# EAGLE design me433-2021 (EAGLE 9.6.2)
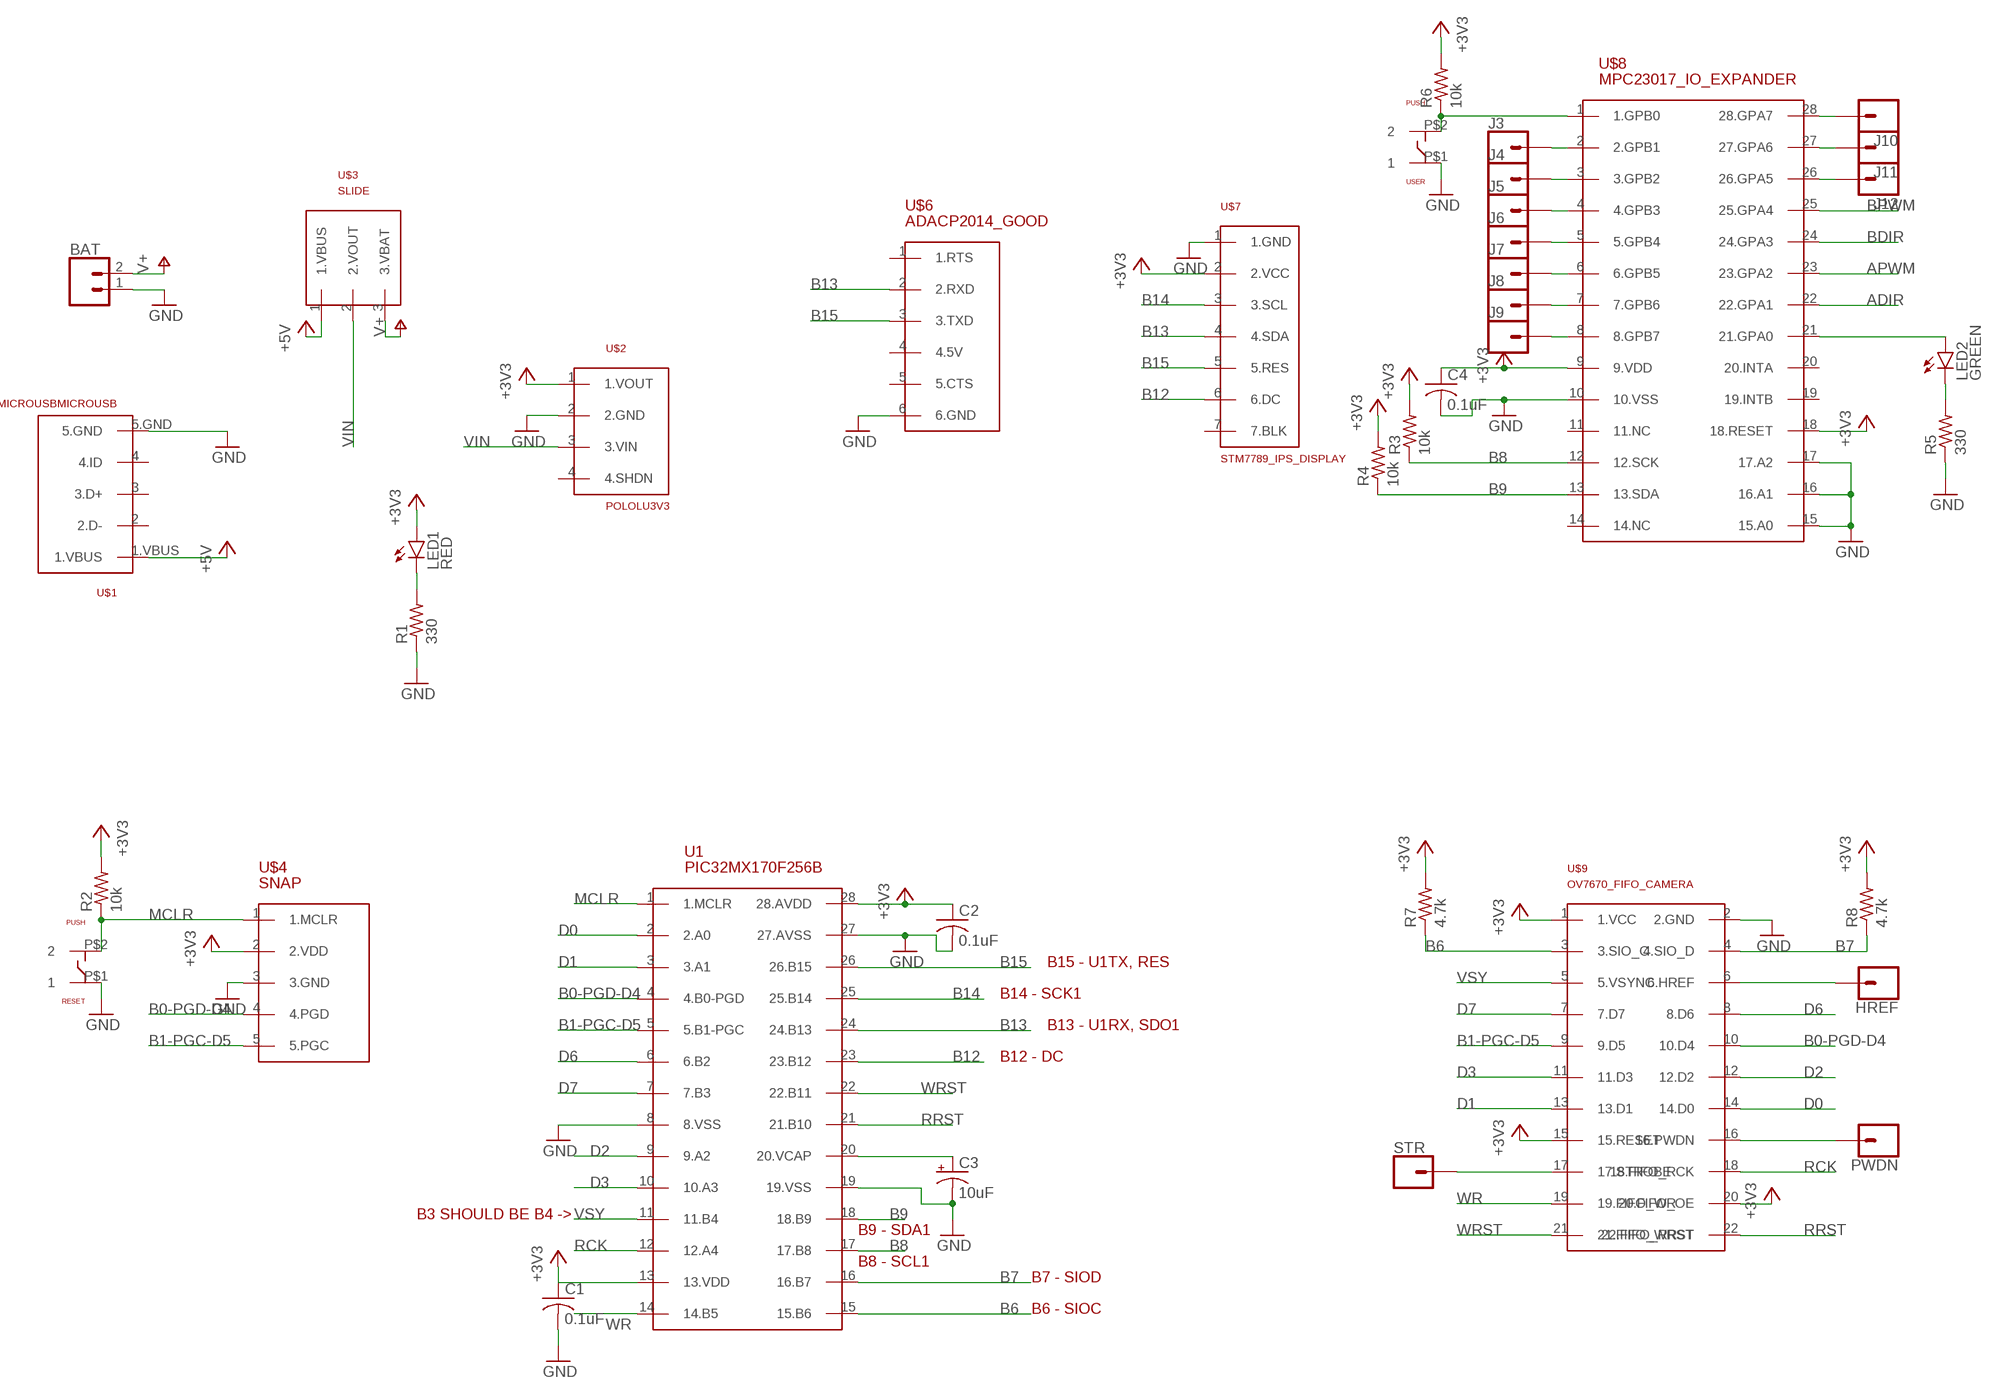
[diagram p0: schematic, sheet 1, part 1 of 2]
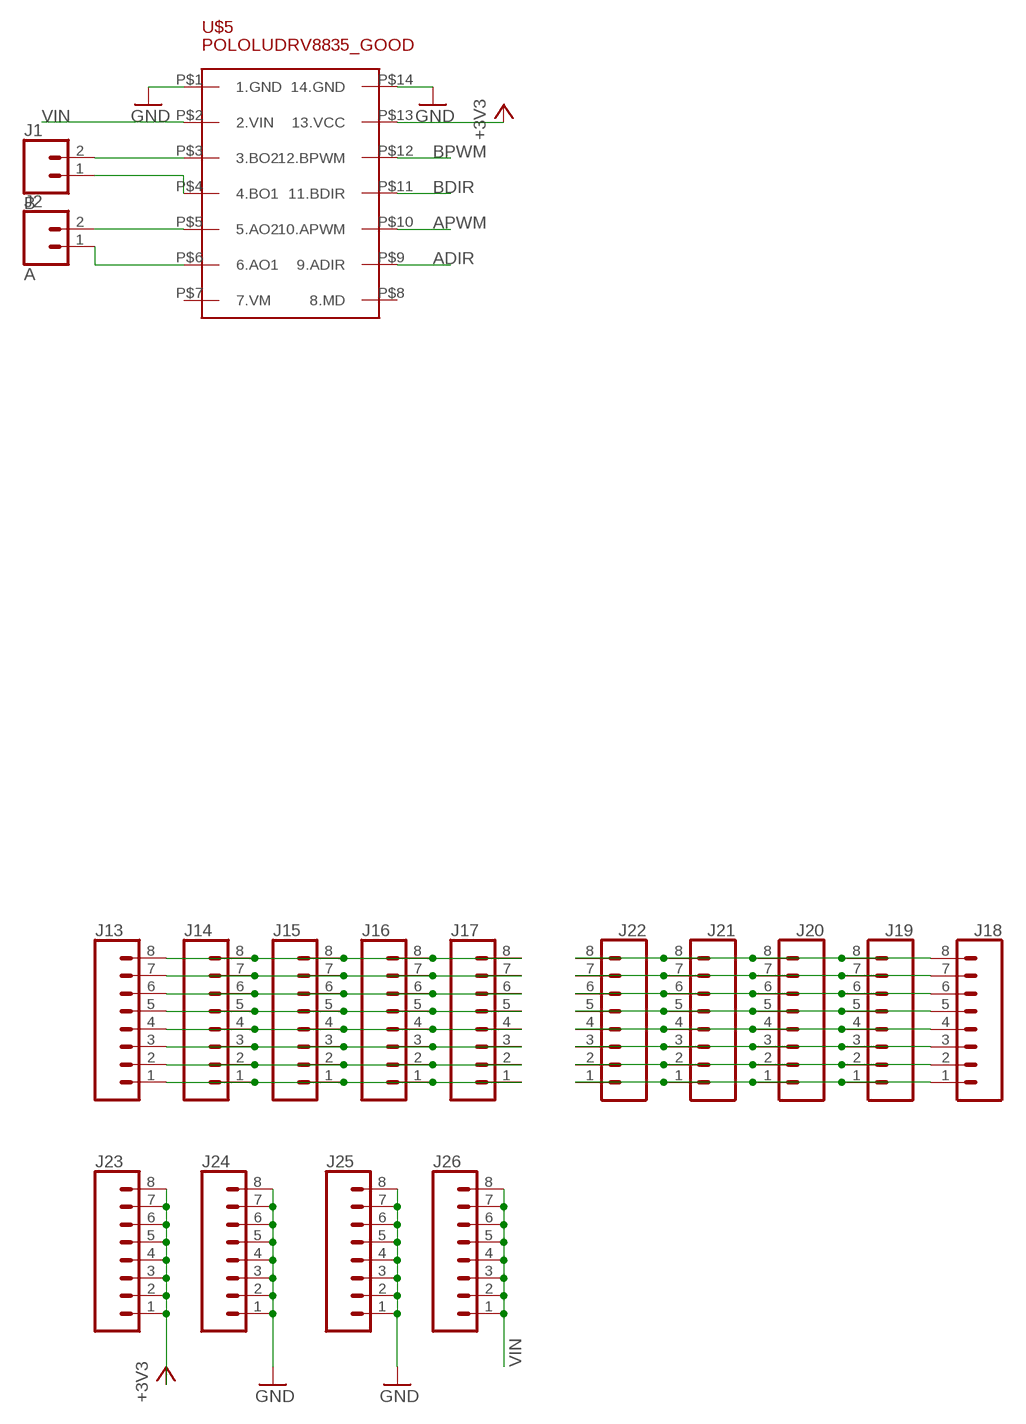
[diagram p1: schematic, sheet 1, part 2 of 2]

## Parts
BAT  CONN_02  [1X02]
C1  0.1uF  C-US025-030X050  [C025-030X050]
C2  0.1uF  C-US025-030X050  [C025-030X050]
C3  10uF  CPOL-USB45181B  [B45181B]
C4  0.1uF  C-US025-030X050  [C025-030X050]
HREF  CONN_01  [1X01]
J1  B  CONN_02  [1X02]
J2  A  CONN_02  [1X02]
J3  CONN_01  [1X01]
J4  CONN_01  [1X01]
J5  CONN_01  [1X01]
J6  CONN_01  [1X01]
J7  CONN_01  [1X01]
J8  CONN_01  [1X01]
J9  CONN_01  [1X01]
J10  CONN_01  [1X01]
J11  CONN_01  [1X01]
J12  CONN_01  [1X01]
J13  CONN_08"  [1X08]
J14  CONN_08"  [1X08]
J15  CONN_08"  [1X08]
J16  CONN_08"  [1X08]
J17  CONN_08"  [1X08]
J18  CONN_08"  [1X08]
J19  CONN_08"  [1X08]
J20  CONN_08"  [1X08]
J21  CONN_08"  [1X08]
J22  CONN_08"  [1X08]
J23  CONN_08"  [1X08]
J24  CONN_08"  [1X08]
J25  CONN_08"  [1X08]
J26  CONN_08"  [1X08]
LED1  RED  LED3MM  [LED3MM]
LED2  GREEN  LED3MM  [LED3MM]
PWDN  CONN_01  [1X01]
R1  330  R-US_0207/10  [0207/10]
R2  10k  R-US_0207/10  [0207/10]
R3  10k  R-US_0207/10  [0207/10]
R4  10k  R-US_0207/10  [0207/10]
R5  330  R-US_0207/10  [0207/10]
R6  10k  R-US_0207/10  [0207/10]
R7  4.7k  R-US_0207/10  [0207/10]
R8  4.7k  R-US_0207/10  [0207/10]
RESET  PUSH  [PUSH]
STR  CONN_01  [1X01]
U1  PIC32MX170F256B  [DIL28-3]
U$1  MICROUSBMICROUSB  [MICROUSB]
U$2  POLOLU3V3  [POLOLU3V3]
U$3  SLIDE  [SLIDE]
U$4  SNAP  [1X05]
U$5  POLOLUDRV8835_GOOD  [POLOLU_DRV8835_H_BRIDGE_BREAKOUT]
U$6  ADACP2014_GOOD  [1X06]
U$7  STM7789_IPS_DISPLAY  [1X07]
U$8  MPC23017_IO_EXPANDER  [DIL28-3]
U$9  OV7670_FIFO_CAMERA  [2X12]
USER  PUSH  [PUSH]

## Nets
+3V3: C2.1 C4.1 J23.1 J23.2 J23.3 J23.4 J23.5 J23.6 J23.7 J23.8 LED1.A R2.2 R3.2 R4.2 R6.2 R7.2 R8.2 U1.28(28.AVDD) U$2.1(1.VOUT) U$4.2(2.VDD) U$5.P$13(13.VCC) U$7.2(2.VCC) U$8.9(9.VDD) U$8.18(18.RESET) U$9.1(1.VCC) U$9.15(15.RESET) U$9.20(20.FIFO_OE)
+5V: U$1.1.VBUS U$3.1(1.VBUS)
ADIR: U$5.P$9(9.ADIR) U$8.22(22.GPA1)
APWM: U$5.P$10(10.APWM) U$8.23(23.GPA2)
B0-PGD-D4: U1.4(4.B0-PGD) U$4.4(4.PGD) U$9.10(10.D4)
B1-PGC-D5: U1.5(5.B1-PGC) U$4.5(5.PGC) U$9.9(9.D5)
B6: R7.1 U1.15(15.B6) U$9.3(3.SIO_C)
B7: R8.1 U1.16(16.B7) U$9.4(4.SIO_D)
B8: R3.1 U1.17(17.B8) U$8.12(12.SCK)
B9: R4.1 U1.18(18.B9) U$8.13(13.SDA)
B12: U1.23(23.B12) U$7.6(6.DC)
B13: U1.24(24.B13) U$6.2(2.RXD) U$7.4(4.SDA)
B14: U1.25(25.B14) U$7.3(3.SCL)
B15: U1.26(26.B15) U$6.3(3.TXD) U$7.5(5.RES)
BDIR: U$5.P$11(11.BDIR) U$8.24(24.GPA3)
BPWM: U$5.P$12(12.BPWM) U$8.25(25.GPA4)
D0: U1.2(2.A0) U$9.14(14.D0)
D1: U1.3(3.A1) U$9.13(13.D1)
D2: U1.9(9.A2) U$9.12(12.D2)
D3: U1.10(10.A3) U$9.11(11.D3)
D6: U1.6(6.B2) U$9.8(8.D6)
D7: U1.7(7.B3) U$9.7(7.D7)
GND: BAT.1 C1.2 C2.2 C3.- C4.2 J24.1 J24.2 J24.3 J24.4 J24.5 J24.6 J24.7 J24.8 J25.1 J25.2 J25.3 J25.4 J25.5 J25.6 J25.7 J25.8 R1.1 R5.1 RESET.P$1 U1.8(8.VSS) U1.19(19.VSS) U1.27(27.AVSS) U$1.5.GND U$2.2(2.GND) U$4.3(3.GND) U$5.P$1(1.GND) U$5.P$14(14.GND) U$6.6(6.GND) U$7.1(1.GND) U$8.10(10.VSS) U$8.15(15.A0) U$8.16(16.A1) U$8.17(17.A2) U$9.2(2.GND) USER.P$1
MCLR: R2.1 RESET.P$2 U1.1(1.MCLR) U$4.1(1.MCLR)
N$1: LED1.K(C) R1.2
N$2: C1.1 U1.13(13.VDD) ; supply symbol labelled +3V3
N$3: C3.+ U1.20(20.VCAP)
N$4: J1.2 U$5.P$3(3.BO2)
N$5: J1.1 U$5.P$4(4.BO1)
N$6: J2.2 U$5.P$5(5.AO2)
N$7: LED2.A U$8.21(21.GPA0)
N$8: LED2.K(C) R5.2
N$9: R6.1 U$8.1(1.GPB0) USER.P$2
N$10: J2.1 U$5.P$6(6.AO1)
N$11: STR.1 U$9.17(17.STROBE)
N$12: PWDN.1 U$9.16(16.PWDN)
N$13: HREF.1 U$9.6(6.HREF)
N$14: J3.1 U$8.2(2.GPB1)
N$15: J4.1 U$8.3(3.GPB2)
N$16: J5.1 U$8.4(4.GPB3)
N$17: J6.1 U$8.5(5.GPB4)
N$18: J7.1 U$8.6(6.GPB5)
N$19: J8.1 U$8.7(7.GPB6)
N$20: J9.1 U$8.8(8.GPB7)
N$21: J10.1 U$8.28(28.GPA7)
N$22: J11.1 U$8.27(27.GPA6)
N$23: J12.1 U$8.26(26.GPA5)
N$24: J13.8 J14.8 J15.8 J16.8 J17.8
N$25: J13.7 J14.7 J15.7 J16.7 J17.7
N$26: J13.6 J14.6 J15.6 J16.6 J17.6
N$27: J13.5 J14.5 J15.5 J16.5 J17.5
N$28: J13.4 J14.4 J15.4 J16.4 J17.4
N$29: J13.3 J14.3 J15.3 J16.3 J17.3
N$30: J13.2 J14.2 J15.2 J16.2 J17.2
N$31: J13.1 J14.1 J15.1 J16.1 J17.1
N$32: J18.8 J19.8 J20.8 J21.8 J22.8
N$33: J18.7 J19.7 J20.7 J21.7 J22.7
N$34: J18.6 J19.6 J20.6 J21.6 J22.6
N$35: J18.5 J19.5 J20.5 J21.5 J22.5
N$36: J18.4 J19.4 J20.4 J21.4 J22.4
N$37: J18.3 J19.3 J20.3 J21.3 J22.3
N$38: J18.2 J19.2 J20.2 J21.2 J22.2
N$39: J18.1 J19.1 J20.1 J21.1 J22.1
RCK: U1.12(12.A4) U$9.18(18.FIFO_RCK)
RRST: U1.21(21.B10) U$9.22(22.FIFO_RRST)
V+: BAT.2 U$3.3(3.VBAT)
VIN: J26.1 J26.2 J26.3 J26.4 J26.5 J26.6 J26.7 J26.8 U$2.3(3.VIN) U$3.2(2.VOUT) U$5.P$2(2.VIN)
VSY: U1.11(11.B4) U$9.5(5.VSYNC)
WR: U1.14(14.B5) U$9.19(19.FIFO_WR)
WRST: U1.22(22.B11) U$9.21(21.FIFO_WRST)
Unconnected: U$1.2(2.D-) U$1.3(3.D+) U$1.4(4.ID) U$2.4(4.SHDN) U$5.P$7(7.VM) U$5.P$8(8.MD) U$6.1(1.RTS) U$6.4(4.5V) U$6.5(5.CTS) U$7.7(7.BLK) U$8.11(11.NC) U$8.14(14.NC) U$8.19(19.INTB) U$8.20(20.INTA)

## Notes on the sheet
- B15 - U1TX, RES
- B14 - SCK1
- B13 - U1RX, SDO1
- B12 - DC
- B3 SHOULD BE B4 ->
- B9 - SDA1
- B8 - SCL1
- B7 - SIOD
- B6 - SIOC

## Library data of the parts
BAT J1 J2 = me433-2021:CONN_02: Multi connection point. Often used as Generic Header-pin footprint for 0.1 inch spaced/style header connections On any of the 0.1 inch spaced packages, you can populate with these: Break Away Headers - Straight <https://www.sparkfun.com/products/116> (PRT-00116) Break Away Male Headers - Right Angle <https://www.sparkfun.com/products/553> (PRT-00553) Female Headers <https://www.sparkfun.com/products/115> (PRT-00115) Break Away Headers - Machine Pin <https://www.sparkfun.com/products/117> (PRT-00117) Break Away Female Headers - Swiss Machine Pin <https://www.sparkfun.com/products/743> (PRT-00743) For SCREWTERMINALS and SPRING TERMINALS visit here: Screw Terimnals on SparkFun.com <https://www.sparkfun.com/search/results?term=Screw+Terminals> (5mm/3.5mm/2.54mm spacing) This device is also useful as a general connection point to wire up your design to another part of your project. Our various solder wires solder well into these plated through hole pads. Hook-Up Wire - Assortment (Stranded, 22 AWG) <https://www.sparkfun.com/products/11375> (PRT-11375) Hook-Up Wire - Assortment (Solid Core, 22 AWG) <https://www.sparkfun.com/products/11367> (PRT-11367) View the entire wire category on our website here <https://www.sparkfun.com/categories/141> Special notes: Molex polarized connector foot print use with: PRT-08233 with associated crimp pins and housings. 2.54_SCREWTERM for use with PRT-10571. 3.5mm Screw Terminal footprints for PRT-08084 5mm Screw Terminal footprints for use with PRT-08432
C1 C2 C4 = me433-2021:C-US: CAPACITOR, American symbol; SPICEPREFIX: C
C3 = me433-2021:CPOL-US: POLARIZED CAPACITOR, American symbol; SPICEPREFIX: C
HREF J3-J12 PWDN STR = me433-2021:CONN_01: Single connection point. Often used as Generic Header-pin footprint for 0.1 inch spaced/style header connections On any of the 0.1 inch spaced packages, you can populate with these: Break Away Headers - Straight <https://www.sparkfun.com/products/116> (PRT-00116) Break Away Male Headers - Right Angle <https://www.sparkfun.com/products/553> (PRT-00553) Female Headers <https://www.sparkfun.com/products/115> (PRT-00115) Break Away Headers - Machine Pin <https://www.sparkfun.com/products/117> (PRT-00117) Break Away Female Headers - Swiss Machine Pin <https://www.sparkfun.com/products/743> (PRT-00743) This device is also useful as a general connection point to wire up your design to another part of your project. Our various solder wires solder well into these plated through hole pads. Hook-Up Wire - Assortment (Stranded, 22 AWG) <https://www.sparkfun.com/products/11375> (PRT-11375) Hook-Up Wire - Assortment (Solid Core, 22 AWG) <https://www.sparkfun.com/products/11367> (PRT-11367) View the entire wire category on our website here <https://www.sparkfun.com/categories/141> Special notes: SMTSO-256-ET is a "flush mount" nut for a 4-40 screw. We mostly use this on specialty testbeds; it is a nice way to connect hardware to your PCB at an adjustable hieght. Also note, the SNAP packages are for using a snappable style connector. We sell a baggie of snaps and they are also used on two LilyPad designs: Snap Assortment - 30 pack (male and female) <https://www.sparkfun.com/products/11347> (DEV-11347) LilyPad Arduino SimpleSnap <https://www.sparkfun.com/products/10941> (DEV-10941) LilyPad SimpleSnap Protoboard <https://www.sparkfun.com/products/10940> (DEV-10940)
J13-J26 = me433-2021:CONN_08: Multi connection point. Often used as Generic Header-pin footprint for 0.1 inch spaced/style header connections On any of the 0.1 inch spaced packages, you can populate with these: Break Away Headers - Straight <https://www.sparkfun.com/products/116> (PRT-00116) Break Away Male Headers - Right Angle <https://www.sparkfun.com/products/553> (PRT-00553) Female Headers <https://www.sparkfun.com/products/115> (PRT-00115) Break Away Headers - Machine Pin <https://www.sparkfun.com/products/117> (PRT-00117) Break Away Female Headers - Swiss Machine Pin <https://www.sparkfun.com/products/743> (PRT-00743) Arduino Stackable Header - 8 Pin <https://www.sparkfun.com/products/9279> (PRT-09279) For SCREWTERMINALS and SPRING TERMINALS visit here: Screw Terimnals on SparkFun.com <https://www.sparkfun.com/search/results?term=Screw+Terminals> (5mm/3.5mm/2.54mm spacing) This device is also useful as a general connection point to wire up your design to another part of your project. Our various solder wires solder well into these plated through hole pads. Hook-Up Wire - Assortment (Stranded, 22 AWG) <https://www.sparkfun.com/products/11375> (PRT-11375) Hook-Up Wire - Assortment (Solid Core, 22 AWG) <https://www.sparkfun.com/products/11367> (PRT-11367) View the entire wire category on our website here <https://www.sparkfun.com/categories/141> Special notes: Molex polarized connector foot print use with SKU : PRT-08231 with associated crimp pins and housings. 1MM SMD Version SKU: PRT-10208 NOTES ON THE VARIANTS LOCK and LOCK_LONGPADS... This footprint was designed to help hold the alignment of a through-hole component (i.e. 6-pin header) while soldering it into place. You may notice that each hole has been shifted either up or down by 0.005 of an inch from it's more standard position (which is a perfectly straight line). This slight alteration caused the pins (the squares in the middle) to touch the edges of the holes. Because they are alternating, it causes a "brace" to hold the component in place. 0.005 has proven to be the perfect amount of "off-center" position when using our standard breakaway headers. Although looks a little odd when you look at the bare footprint, once you have a header in there, the alteration is very hard to notice. Also,if you push a header all the way into place, it is covered up entirely on the bottom side.; PROD_ID: CONN-08438
LED1 LED2 = me433-2021:LED: LED OSRAM: - CHIPLED LG R971, LG N971, LY N971, LG Q971, LY Q971, LO R971, LY R971 LH N974, LH R974 LS Q976, LO Q976, LY Q976 LO Q996 - Hyper CHIPLED LW Q18S LB Q993, LB Q99A, LB R99A - SideLED LS A670, LO A670, LY A670, LG A670, LP A670 LB A673, LV A673, LT A673, LW A673 LH A674 LY A675 LS A676, LA A676, LO A676, LY A676, LW A676 LS A679, LY A679, LG A679 - Hyper Micro SIDELED® LS Y876, LA Y876, LO Y876, LY Y876 LT Y87S - SmartLED LW L88C, LW L88S LB L89C, LB L89S, LG L890 LS L89K, LO L89K, LY L89K LS L896, LA L896, LO L896, LY L896 - TOPLED LS T670, LO T670, LY T670, LG T670, LP T670 LSG T670, LSP T670, LSY T670, LOP T670, LYG T670 LG T671, LOG T671, LSG T671 LB T673, LV T673, LT T673, LW T673 LH T674 LS T676, LA T676, LO T676, LY T676, LB T676, LH T676, LSB T676, LW T676 LB T67C, LV T67C, LT T67C, LS T67K, LO T67K, LY T67K, LW E67C LS E67B, LA E67B, LO E67B, LY E67B, LB E67C, LV E67C, LT E67C LW T67C LS T679, LY T679, LG T679 LS T770, LO T770, LY T770, LG T770, LP T770 LB T773, LV T773, LT T773, LW T773 LH T774 LS E675, LA E675, LY E675, LS T675 LS T776, LA T776, LO T776, LY T776, LB T776 LHGB T686 LT T68C, LB T68C - Hyper Mini TOPLED® LB M676 - Mini TOPLED Santana® LG M470 LS M47K, LO M47K, LY M47K Source: http://www.osram.convergy.de LUXEON: - LUMILED® LXK2-PW12-R00, LXK2-PW12-S00, LXK2-PW14-U00, LXK2-PW14-V00 LXK2-PM12-R00, LXK2-PM12-S00, LXK2-PM14-U00 LXK2-PE12-Q00, LXK2-PE12-R00, LXK2-PE12-S00, LXK2-PE14-T00, LXK2-PE14-U00 LXK2-PB12-K00, LXK2-PB12-L00, LXK2-PB12-M00, LXK2-PB14-N00, LXK2-PB14-P00, LXK2-PB14-Q00 LXK2-PR12-L00, LXK2-PR12-M00, LXK2-PR14-Q00, LXK2-PR14-R00 LXK2-PD12-Q00, LXK2-PD12-R00, LXK2-PD12-S00 LXK2-PH12-R00, LXK2-PH12-S00 LXK2-PL12-P00, LXK2-PL12-Q00, LXK2-PL12-R00 Source: www.luxeon.com KINGBRIGHT: KA-3528ASYC Source: www.kingbright.com
R1-R8 = me433-2021:R-US_: RESISTOR, American symbol; SPICEPREFIX: R
RESET USER = me433-2021:PUSH
U1 = me433-2021:PIC32MX170F256B
U$1 = me433-2021:MICROUSB
U$2 = me433-2021:POLOLU3V3
U$3 = me433-2021:SLIDE
U$4 = me433-2021:SNAP
U$5 = me433-2021:POLOLUDRV8835_GOOD
U$6 = me433-2021:ADACP2014_GOOD
U$7 = me433-2021:STM7789_IPS_DISPLAY
U$8 = me433-2021:MPC23017_IO_EXPANDER
U$9 = me433-2021:OV7670_FIFO_CAMERA

## Board
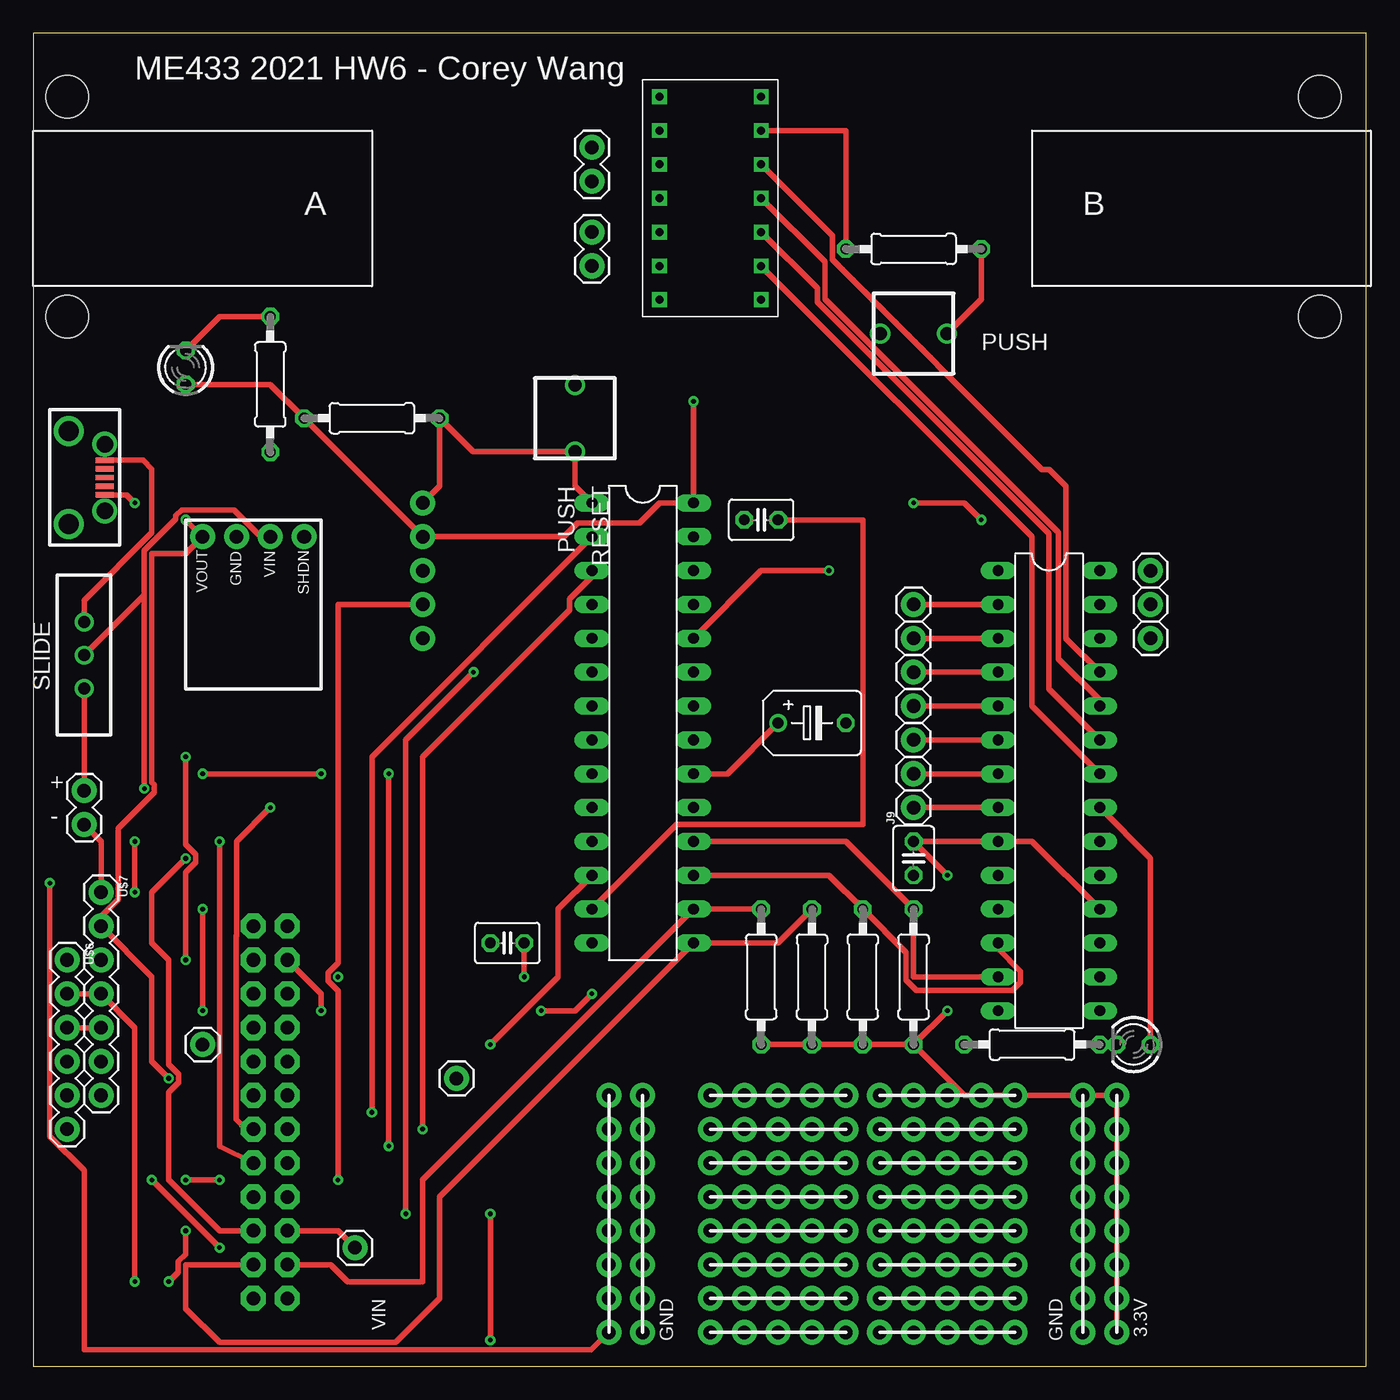
[diagram p2: board, top side]
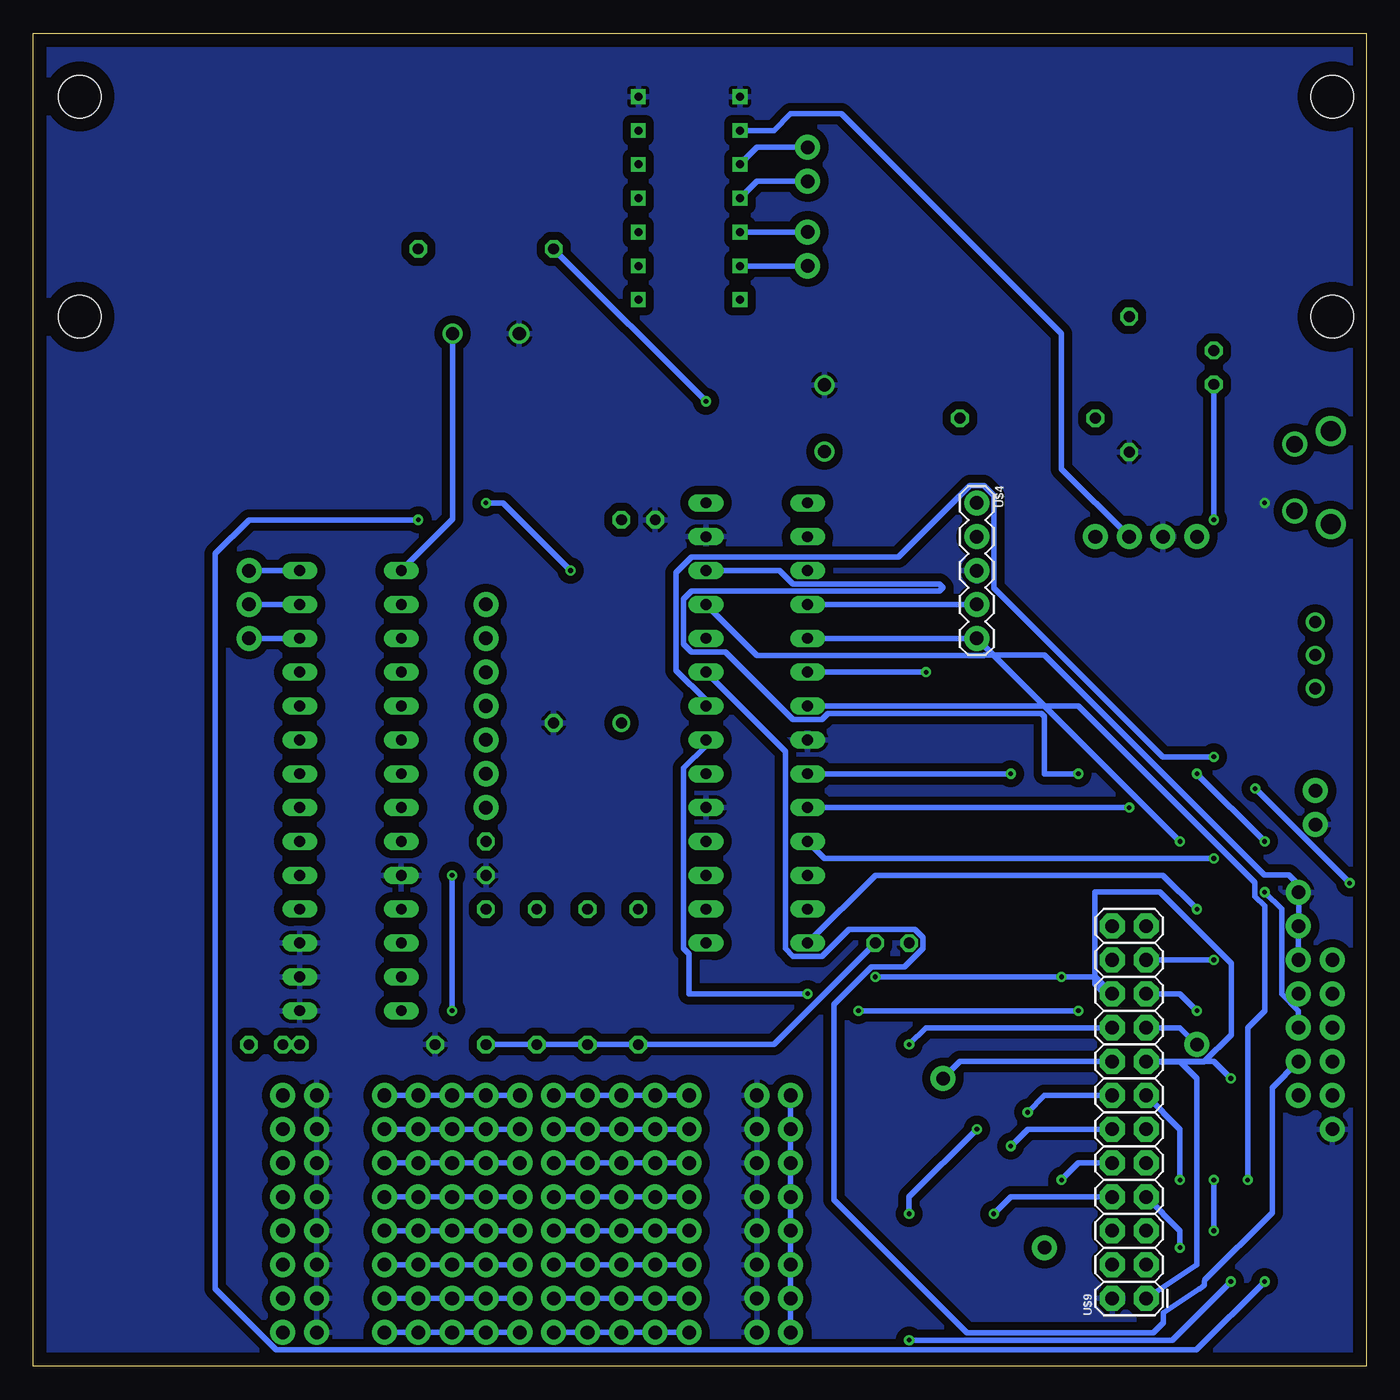
[diagram p3: board, bottom side, seen from below]

Size 100 x 100 mm. Coordinates in mm from the lower left corner, seen from the top.
Outline: 0,0 100,0 100,100 0,100 0,0
Copper layers (1*16): Top 0.035mm / dielectric 1.5mm / Bottom 0.035mm
Design rules "default": minimum track width 6mil, minimum drill 0.35mm, track to track 6mil, track to pad 6mil, pad to pad 6mil, via to via 6mil, smd to smd 6mil, copper to edge 40mil, drill to drill 6mil, minimum pad ring 10mil, minimum via ring 8mil, stop-mask expansion 4mil, vias tented up to drill 0mil, thermal gap 10mil
Holes 3.17 mm at 2.54,95.25 2.54,78.74 96.52,95.25 96.52,78.74

### Footprints (pad centres in the part's own frame; a part is rotated, then mirrored left to right if it is on the bottom)
1X02 = drill 1.016 pad 1.88: 1 0,0; 2 2.54,0
C025-030X050 = drill 0.813 octagon: 1 -1.27,0; 2 1.27,0
B45181B = drill 0.813: + -2.54,0 | drill 0.813 octagon: - 2.54,0
1X01 = drill 1.016 pad 1.88: 1 0,0
1X08 = drill 1.016 pad 1.88: 1 0,0; 2 2.54,0; 3 5.08,0; 4 7.62,0; 5 10.16,0; 6 12.7,0; 7 15.24,0; 8 17.78,0
LED3MM = drill 0.813 octagon: A -1.27,0; K 1.27,0
0207/10 = drill 0.813 octagon: 1 -5.08,0; 2 5.08,0
PUSH = drill 1: P$1 -2.5,0; P$2 2.5,0
DIL28-3 = drill 0.813 long: 1 -16.51,-3.81; 2 -13.97,-3.81; 3 -11.43,-3.81; 4 -8.89,-3.81; 5 -6.35,-3.81; 6 -3.81,-3.81; 7 -1.27,-3.81; 8 1.27,-3.81; 9 3.81,-3.81; 10 6.35,-3.81; 11 8.89,-3.81; 12 11.43,-3.81; 13 13.97,-3.81; 14 16.51,-3.81; 15 16.51,3.81; 16 13.97,3.81; 17 11.43,3.81; 18 8.89,3.81; 19 6.35,3.81; 20 3.81,3.81; 21 1.27,3.81; 22 -1.27,3.81; 23 -3.81,3.81; 24 -6.35,3.81; 25 -8.89,3.81; 26 -11.43,3.81; 27 -13.97,3.81; 28 -16.51,3.81
MICROUSB = smd 0.4 x 1.35: 1.VBUS -1.3,2.7; 2 -0.65,2.7; 3 0,2.7; 4 0.65,2.7; 5.GND 1.3,2.7 | drill 1.25 pad 1.778: P$6 -2.5,2.7 | drill 1.25 pad 1.676: P$7 2.5,2.7 | drill 1.5: P$8 -3.5,0; P$9 3.5,0
POLOLU3V3 = drill 1.016 pad 1.88: 1 0,3.81; 2 0,1.27; 3 0,-1.27; 4 0,-3.81
SLIDE = drill 0.9: 1 -2.5,0; 2 0,0; 3 2.5,0
1X05 = drill 1.016 pad 1.88: 1 0,0; 2 2.54,0; 3 5.08,0; 4 7.62,0; 5 10.16,0
POLOLU_DRV8835_H_BRIDGE_BREAKOUT = drill 0.6 square: P$1 -3.81,7.62; P$2 -3.81,5.08; P$3 -3.81,2.54; P$4 -3.81,0; P$5 -3.81,-2.54; P$6 -3.81,-5.08; P$7 -3.81,-7.62; P$8 3.81,-7.62; P$9 3.81,-5.08; P$10 3.81,-2.54; P$11 3.81,0; P$12 3.81,2.54; P$13 3.81,5.08; P$14 3.81,7.62
1X06 = drill 1.016 pad 1.88: 1 0,0; 2 2.54,0; 3 5.08,0; 4 7.62,0; 5 10.16,0; 6 12.7,0
1X07 = drill 1.016 pad 1.88: 1 0,0; 2 2.54,0; 3 5.08,0; 4 7.62,0; 5 10.16,0; 6 12.7,0; 7 15.24,0
2X12 = drill 1.016 pad 1.88 octagon: 1 0,0; 2 0,2.54; 3 2.54,0; 4 2.54,2.54; 5 5.08,0; 6 5.08,2.54; 7 7.62,0; 8 7.62,2.54; 9 10.16,0; 10 10.16,2.54; 11 12.7,0; 12 12.7,2.54; 13 15.24,0; 14 15.24,2.54; 15 17.78,0; 16 17.78,2.54; 17 20.32,0; 18 20.32,2.54; 19 22.86,0; 20 22.86,2.54; 21 25.4,0; 22 25.4,2.54; 23 27.94,0; 24 27.94,2.54

### Placement (x,y rotation side)
BAT  3.81,40.64 90 top
C1  54.61,63.5 180 top
C2  35.56,31.75 180 top
C3  58.42,48.26 0 top
C4  66.04,38.1 270 top
HREF  24.13,8.89 90 top
J1  41.91,88.9 90 top
J2  41.91,82.55 90 top
J3  66.04,57.15 90 top
J4  66.04,54.61 90 top
J5  66.04,52.07 90 top
J6  66.04,49.53 90 top
J7  66.04,46.99 90 top
J8  66.04,44.45 90 top
J9  66.04,41.91 90 top
J10  83.82,59.69 90 top
J11  83.82,57.15 90 top
J12  83.82,54.61 90 top
J13  50.8,2.54 90 top
J14  53.34,2.54 90 top
J15  55.88,2.54 90 top
J16  58.42,2.54 90 top
J17  60.96,2.54 90 top
J18  63.5,2.54 90 top
J19  66.04,2.54 90 top
J20  68.58,2.54 90 top
J21  71.12,2.54 90 top
J22  73.66,2.54 90 top
J23  81.28,2.54 90 top
J24  45.72,2.54 90 top
J25  78.74,2.54 90 top
J26  43.18,2.54 90 top
LED1  11.43,74.93 90 top
LED2  82.55,24.13 180 top
PWDN  31.75,21.59 90 top
R1  17.78,73.66 90 top
R2  25.4,71.12 180 top
R3  62.23,29.21 270 top
R4  66.04,29.21 270 top
R5  74.93,24.13 0 top
R6  66.04,83.82 180 top
R7  58.42,29.21 270 top
R8  54.61,29.21 270 top
RESET  40.64,71.12 270 top
STR  12.7,24.13 90 top
U1  45.72,48.26 270 top
U$1  2.67,66.67 270 top
U$2  16.51,62.23 90 top
U$3  3.81,53.34 270 top
U$4  29.21,64.77 270 bottom
U$5  50.8,87.63 0 top
U$6  2.54,30.48 270 top
U$7  5.08,35.56 270 top
U$8  76.2,43.18 270 top
U$9  16.51,5.08 90 bottom
USER  66.04,77.47 0 top

### Tracks (layer width: path | path; a pad name or v marks a point on that pad's centre or on a via)
+3V3  (via drill 0.35)
  Top 0.406: v11.43,63.5 U$2.1 11.43,60.96 8.89,60.96 8.89,43.81 9.06,43.63 9.06,43.02 6.38,40.34 6.38,35.02 5.08,33.73 U$7.2 8.89,29.21 8.89,22.86 v10.16,21.59 | LED1.A 17.78,73.66 R2.2 U$4.2 39.81,62.23 40.83,63.25 45.47,63.25 46.99,64.77 U1.28 v49.53,72.39 | R6.2 60.96,92.71 U$5.P$13 | v36.83,29.21 C2.1 | R8.2 R4.2 | v68.58,26.67 R4.2 | v68.58,36.83 C4.1 U$8.9 74.93,39.37 U$8.18 | R4.2 69.85,20.32 J23.8 J23.7 J23.6 J23.5 J23.4 J23.3 J23.2 J23.1
  Bottom 0.406: v11.43,63.5 LED1.A | v49.53,72.39 R6.2 | C2.1 44.45,24.13 R8.2 R7.2 R3.2 R4.2 | v68.58,36.83 v68.58,26.67 | U$9.15 13.97,22.86 12.7,21.59 12.7,7.62 U$9.1 | U$9.15 11.43,22.86 v10.16,21.59 | U$9.15 16.48,22.84 12.16,22.84 10.13,24.86 10.13,30.22 15.5,35.59 20.34,35.59 20.34,28.67 19.61,27.94 U$9.20 20.32,29.21 v22.86,29.21 v36.83,29.21
+5V
  Top 0.406: U$1.1.VBUS 8.22,67.97 8.89,67.31 8.89,62.54 3.81,57.46 U$3.1
ADIR
  Top 0.406: U$8.22 74.93,49.53 74.93,62.23 U$5.P$9
APWM
  Top 0.406: U$8.23 76.2,50.8 76.2,62.45 58.83,79.82 58.83,80.87 U$5.P$10
B0-PGD-D4  (via drill 0.35)
  Top 0.406: v22.86,13.97 22.86,28.17 22.13,28.91 22.13,29.51 22.86,30.25 22.86,57.15 U$4.4
  Bottom 0.406: U$4.4 U1.4 | v22.86,13.97 21.59,15.24 U$9.10
B1-PGC-D5  (via drill 0.35)
  Top 0.406: U$9.9 13.99,16.48 13.99,23.4 13.97,23.42 v13.97,39.37
  Bottom 0.406: U1.5 U$4.5 v13.97,39.37
B6
  Top 0.406: R7.1 55.88,31.75 U1.15 30.48,12.7 30.48,5.08 27.18,1.78 13.97,1.78 11.43,4.32 11.43,7.62 U$9.3
B7
  Top 0.406: R8.1 U1.16 29.21,13.97 29.21,6.35 24.69,6.35 24.67,6.33 23.59,6.33 22.3,7.62 U$9.4
B8
  Top 0.406: U1.17 59.69,36.83 R3.1 65.48,31.04 65.48,28.98 66.27,28.19 73.47,28.19 74.07,28.79 74.07,29.63 72.39,31.31 U$8.12
B9
  Top 0.406: U1.18 60.96,39.37 R4.1 66.04,29.21 U$8.13
B12
  Bottom 0.406: U$7.6 7.06,20.88 7.06,11.51 12.11,6.47 12.14,6.29 12.14,6.12 12.19,6.08 12.2,6.01 12.34,5.92 12.47,5.79 12.53,5.79 15.21,4 15.21,3.27 15.97,2.52 29.98,2.52 39.93,12.47 39.93,27.15 37.13,29.94 34.66,29.94 33.27,31.33 33.27,32.17 33.87,32.77 38.8,32.77 40.83,30.73 42.99,30.73 43.59,31.33 43.59,46.13 U1.23
B13  (via drill 0.35)
  Top 0.406: U$6.2 U$7.4 7.62,25.4 v7.62,6.35 | U1.24 54.61,59.69 v59.69,59.69 | v66.04,64.77 69.85,64.77 v71.12,63.5
  Bottom 0.406: v59.69,59.69 64.77,64.77 v66.04,64.77 | v71.12,63.5 83.82,63.5 86.36,60.96 86.36,5.79 81.79,1.22 12.75,1.22 v7.62,6.35
B14
  Bottom 0.406: U1.25 45.7,53.31 28.67,53.31 28.65,53.34 24.13,53.34 7.64,36.85 5.81,36.85 5.05,36.1 5.05,32.48 5.08,32.46 U$7.3
B15  (via drill 0.35)
  Top 0.406: U$7.5 U$6.3 | v21.59,44.45 v12.7,44.45 | v7.62,39.37 v7.62,35.56
  Bottom 0.406: U1.26 44.01,59.69 42.99,58.67 32,58.67 31.75,58.42 32,58.17 50.61,58.17 51.21,57.57 51.21,54.19 50.61,53.59 48.07,53.59 42.99,48.51 40.83,48.51 40.37,48.97 24.36,48.97 24.13,48.74 24.13,44.45 v21.59,44.45 | v12.7,44.45 v7.62,39.37 | v7.62,35.56 6.35,34.29 6.35,27.94 5.08,26.67 U$7.5
BDIR
  Top 0.406: U$5.P$11 59.38,82.86 59.38,80.06 76.91,62.53 76.91,53.07 80.01,49.97 U$8.24
BPWM
  Top 0.406: U$8.25 77.47,54.61 77.47,66.04 76.22,67.28 75.66,67.28 59.94,83 59.94,84.84 U$5.P$12
D0  (via drill 0.35)
  Top 0.406: v25.4,19.05 25.4,45.72 U1.2
  Bottom 0.406: v25.4,19.05 24.13,20.32 U$9.14
D1  (via drill 0.35)
  Top 0.406: U1.3 41.91,59.25 40.23,57.57 40.23,56.74 29.21,45.72 v29.21,17.78 | v34.29,11.43 v34.29,1.95 34.29,1.78 | v13.97,13.97 v11.43,13.97 | v10.16,6.35 10.87,7.06 10.87,7.85 11.43,8.41 v11.43,10.16
  Bottom 0.406: v29.21,17.78 34.29,12.7 v34.29,11.43 | v34.29,1.95 14.56,1.95 v10.16,6.35 | U$9.13 13.97,17.78 v13.97,13.97 | v11.43,13.97 v11.43,10.16
D2  (via drill 0.35)
  Top 0.406: v26.67,16.51 v26.67,44.45
  Bottom 0.406: U$9.12 25.4,17.78 v26.67,16.51 | v26.67,44.45 U1.9
D3  (via drill 0.35)
  Top 0.406: U$9.11 15.95,17.78 15.21,18.51 15.21,32.29 15.24,32.31 15.24,39.37 v17.78,41.91
  Bottom 0.406: v17.78,41.91 U1.10
D6  (via drill 0.35)
  Top 0.406: v27.94,11.43 27.94,46.99 v33.02,52.07
  Bottom 0.406: v27.94,11.43 26.67,12.7 U$9.8 | v33.02,52.07 U1.6
D7  (via drill 0.35)
  Top 0.406: v13.97,8.89 v8.89,13.97
  Bottom 0.406: U1.7 21.59,49.53 8.35,36.29 8.35,35.26 7.62,34.52 7.62,26.67 8.89,25.4 v8.89,13.97 | U$9.7 13.97,10.16 v13.97,8.89
GND  (via drill 0.35)
  Top 0.406: U$1.5.GND 7.01,65.38 v7.62,64.77 | BAT.1 5.08,39.37 U$7.1
  pour Bottom (isolate 0.61): 0,100.33 0,0 100.33,0 100.33,100.33
MCLR
  Top 0.406: U1.1 40.64,66.04 RESET.P$2 32.98,68.62 R2.1 30.48,66.04 U$4.1
N$1
  Top 0.406: LED1.K 13.97,78.74 R1.2
N$2
  Top 0.406: U1.13 48.26,40.64 62.23,40.64 62.23,63.5 C1.1
N$3
  Top 0.406: C3.+ 52.07,44.45 U1.20
N$4
  Bottom 0.406: J1.2 45.72,91.44 U$5.P$3
N$5
  Bottom 0.406: J1.1 45.72,88.9 U$5.P$4
N$6
  Bottom 0.406: U$5.P$5 J2.2
N$7
  Top 0.406: LED2.A 83.82,38.1 U$8.21
N$8
  Top 0.406: R5.2 LED2.K
N$9
  Top 0.406: R6.1 71.12,80.05 USER.P$2
  Bottom 0.406: USER.P$2 68.54,63.54 U$8.1
N$10
  Bottom 0.406: J2.1 U$5.P$6
N$11
  Bottom 0.406: U$9.17 13.97,25.4 STR.1
N$12
  Bottom 0.406: PWDN.1 30.48,22.86 U$9.16
N$13
  Top 0.406: HREF.1 22.86,10.16 U$9.6
N$14
  Top 0.406: J3.1 U$8.2
N$15
  Top 0.406: U$8.3 J4.1
N$16
  Top 0.406: J5.1 U$8.4
N$17
  Top 0.406: U$8.5 J6.1
N$18
  Top 0.406: J7.1 U$8.6
N$19
  Top 0.406: U$8.7 J8.1
N$20
  Top 0.406: J9.1 U$8.8
N$21
  Bottom 0.406: U$8.28 J10.1
N$22
  Bottom 0.406: U$8.27 J11.1
N$23
  Bottom 0.406: U$8.26 J12.1
N$24
  Bottom 0.406: J13.8 J14.8 J15.8 J16.8 J17.8
N$25
  Bottom 0.406: J17.7 J16.7 J15.7 J14.7 J13.7
N$26
  Bottom 0.406: J13.6 J14.6 J15.6 J16.6 J17.6
N$27
  Bottom 0.406: J17.5 J16.5 J15.5 J14.5 J13.5
N$28
  Bottom 0.406: J13.4 J14.4 J15.4 J16.4 J17.4
N$29
  Bottom 0.406: J13.3 J14.3 J15.3 J16.3 J17.3
N$30
  Bottom 0.406: J13.2 J14.2 J15.2 J16.2 J17.2
N$31
  Bottom 0.406: J13.1 J14.1 J15.1 J16.1 J17.1
N$32
  Bottom 0.406: J18.8 J19.8 J20.8 J21.8 J22.8
N$33
  Bottom 0.406: J18.7 J19.7 J20.7 J21.7 J22.7
N$34
  Bottom 0.406: J18.6 J19.6 J20.6 J21.6 J22.6
N$35
  Bottom 0.406: J18.5 J19.5 J20.5 J21.5 J22.5
N$36
  Bottom 0.406: J18.4 J19.4 J20.4 J21.4 J22.4
N$37
  Bottom 0.406: J18.3 J19.3 J20.3 J21.3 J22.3
N$38
  Bottom 0.406: J18.2 J19.2 J20.2 J21.2 J22.2
N$39
  Bottom 0.406: J18.1 J19.1 J20.1 J21.1 J22.1
RCK  (via drill 0.35)
  Top 0.406: U1.12 39.37,34.29 39.37,29.21 v34.29,24.13
  Bottom 0.406: v34.29,24.13 33.02,25.4 U$9.18
RRST  (via drill 0.35)
  Top 0.406: v41.91,27.94 40.64,26.67 v38.1,26.67 | v21.59,26.67 21.59,27.94 U$9.22
  Bottom 0.406: U1.21 49.53,46.55 51.21,44.87 51.21,31.33 50.8,30.92 50.8,27.94 v41.91,27.94 | v38.1,26.67 v21.59,26.67
V+
  Top 0.406: U$3.3 BAT.2
VIN  (via drill 0.35)
  Top 0.406: U$3.2 8.33,57.86 | 8.33,57.86 8.33,61.19 10.7,63.56 10.7,63.8 11.13,64.23 15.07,64.23 17.07,62.23 U$2.3 | v1.25,36.24 1.25,17.24 3.81,14.68 3.81,1.22 41.86,1.22 J26.1 | 8.33,57.86 v8.33,43.33
  Bottom 0.406: U$5.P$2 44.45,92.71 43.18,93.98 39.37,93.98 22.86,77.47 22.86,67.31 U$2.3 | J26.8 J26.7 J26.6 J26.5 J26.4 J26.3 J26.2 J26.1 | v8.33,43.33 v1.25,36.24
VSY  (via drill 0.35)
  Top 0.406: U$9.5 13.97,10.16 10.16,13.97 10.16,20.55 10.89,21.29 10.89,21.89 10.16,22.63 10.16,30.48 8.89,31.75 8.89,35.56 v11.43,38.1
  Bottom 0.406: U1.11 40.64,38.1 v11.43,38.1
WR  (via drill 0.35)
  Top 0.406: v12.7,34.29 v12.7,26.67
  Bottom 0.406: U1.14 36.83,36.83 15.24,36.83 v12.7,34.29 | 15.24,27.94 U$9.19 13.97,27.94 v12.7,26.67
WRST  (via drill 0.35)
  Top 0.406: v11.43,45.72 11.43,39.14 12.16,38.4 12.16,37.8 11.43,37.06 v11.43,30.48
  Bottom 0.406: U1.22 49.53,49.97 51.77,52.21 51.77,59.55 50.61,60.71 35.11,60.71 29.75,66.06 28.67,66.06 27.91,65.31 27.91,58.4 15.24,45.72 v11.43,45.72 | v11.43,30.48 U$9.21

### Text on the board
tNames: ME433 2021 HW6 - Corey Wang | A | B | + | - | VIN | GND | GND | 3.3V